# EAGLE design screwshield-v1.0 (EAGLE 6.2)
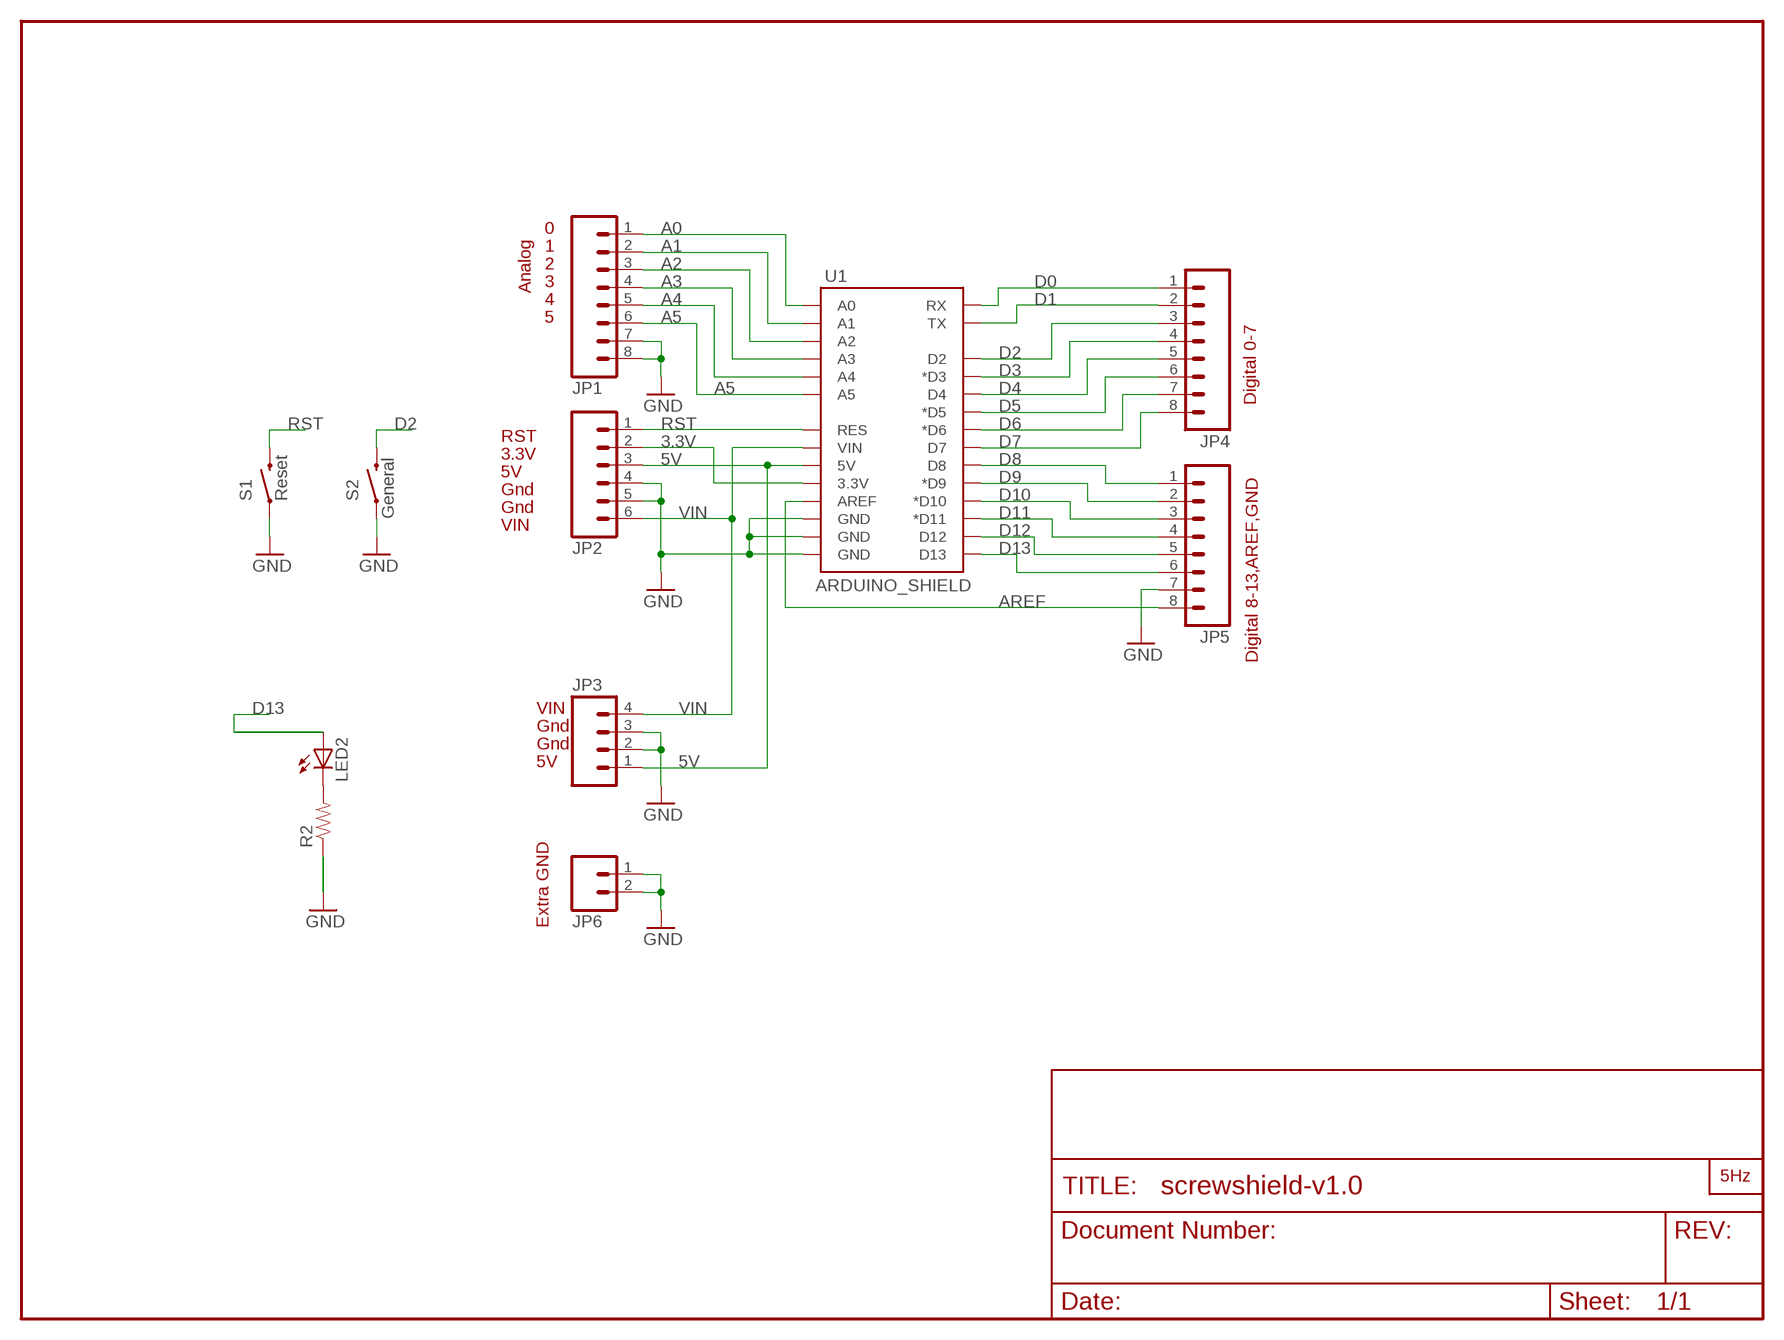
[diagram p0: schematic, sheet 1]

## Parts
JP1  M083.5MM-8  [SCREWTERMINAL-3.5MM-8]
JP2  M063.5MM-6  [SCREWTERMINAL-3.5MM-6]
JP3  M04SCREW  [SCREWTERMINAL-3.5MM-4]
JP4  M083.5MM-8  [SCREWTERMINAL-3.5MM-8]
JP5  M083.5MM-8  [SCREWTERMINAL-3.5MM-8]
JP6  M023.5MM  [SCREWTERMINAL-3.5MM-2]
LED2  LED0603  [LED-0603]
R2  RESISTOR0603-RES  [0603-RES]
S1  Reset  SWITCH-MOMENTARY-2PTH  [TACTILE-PTH]
S2  General  SWITCH-MOMENTARY-2PTH  [TACTILE-PTH]
U1  ARDUINO_SHIELD  ARDUINO_SHIELDNOHOLES  [DUEMILANOVE_SHIELD_NOHOLES]
U$1  LOGO_SILKL15MM  [LARGO_15MM]

## Nets
3.3V: JP2.2 U1.3.3V
5V: JP2.3 JP3.1 U1.5V
A0: JP1.1 U1.A0
A1: JP1.2 U1.A1
A2: JP1.3 U1.A2
A3: JP1.4 U1.A3
A4: JP1.5 U1.A4
A5: JP1.6 U1.A5
AREF: JP5.8 U1.AREF
D0: JP4.1 U1.RX
D1: JP4.2 U1.TX
D2: JP4.3 S2.3 U1.D2
D3: JP4.4 U1.D3(*D3)
D4: JP4.5 U1.D4
D5: JP4.6 U1.D5(*D5)
D6: JP4.7 U1.D6(*D6)
D7: JP4.8 U1.D7
D8: JP5.1 U1.D8
D9: JP5.2 U1.D9(*D9)
D10: JP5.3 U1.D10(*D10)
D11: JP5.4 U1.D11(*D11)
D12: JP5.5 U1.D12
D13: JP5.6 LED2.A U1.D13
GND: JP1.7 JP1.8 JP2.4 JP2.5 JP3.2 JP3.3 JP5.7 JP6.1 JP6.2 R2.1 S1.1 S2.1 U1.GND@0(GND) U1.GND@1(GND) U1.GND@2(GND)
N$1: LED2.C R2.2
RST: JP2.1 S1.3 U1.RES
VIN: JP2.6 JP3.4 U1.VIN

## Notes on the sheet
- 0
- Analog
- 1
- 2
- 3
- 4
- 5
- Digital 0-7
- RST
- 3.3V
- 5V
- Gnd
- Gnd
- VIN
- Digital 8-13,AREF,GND
- VIN
- Gnd
- Gnd
- 5V
- Extra GND

## Library data of the parts
JP1 JP4 JP5 = SparkFun:M08: Header 8 Standard 8-pin 0.1" header. Use with straight break away headers (SKU : PRT-00116), right angle break away headers (PRT-00553), swiss pins (PRT-00743), machine pins (PRT-00117), and female headers (PRT-00115).
JP2 = SparkFun:M06: Header 6 Standard 6-pin 0.1" header. Use with straight break away headers (SKU : PRT-00116), right angle break away headers (PRT-00553), swiss pins (PRT-00743), machine pins (PRT-00117), and female headers (PRT-00115). Molex polarized connector foot print use with SKU : PRT-08094 with associated crimp pins and housings. NOTES ON THE VARIANTS LOCK and LOCK_LONGPADS... This footprint was designed to help hold the alignment of a through-hole component (i.e. 6-pin header) while soldering it into place. You may notice that each hole has been shifted either up or down by 0.005 of an inch from it's more standard position (which is a perfectly straight line). This slight alteration caused the pins (the squares in the middle) to touch the edges of the holes. Because they are alternating, it causes a "brace" to hold the component in place. 0.005 has proven to be the perfect amount of "off-center" position when using our standard breakaway headers. Although looks a little odd when you look at the bare footprint, once you have a header in there, the alteration is very hard to notice. Also, if you push a header all the way into place, it is covered up entirely on the bottom side. This idea of altering the position of holes to aid alignment will be further integrated into the Sparkfun Library for other footprints. It can help hold any component with 3 or more connection pins.
JP3 = SparkFun:M04: Header 4 Standard 4-pin 0.1" header. Use with straight break away headers (SKU : PRT-00116), right angle break away headers (PRT-00553), swiss pins (PRT-00743), machine pins (PRT-00117), and female headers (PRT-00115). Molex polarized connector foot print use with SKU : PRT-08231 with associated crimp pins and housings.
JP6 = SparkFun:M02: Header 2 Standard 2-pin 0.1" header. Use with straight break away headers (SKU : PRT-00116), right angle break away headers (PRT-00553), swiss pins (PRT-00743), machine pins (PRT-00117), and female headers (PRT-00115). Molex polarized connector foot print use with SKU : PRT-08233 with associated crimp pins and housings.
LED2 = SparkFun:LED: LEDs Standard schematic elements and footprints for 5mm, 3mm, 1206, and 0603 sized LEDs. 5mm - Spark Fun Electronics SKU : COM-00529 (and others)
R2 = SparkFun:RESISTOR: Resistor Basic schematic elements and footprints for 0603, 1206, and PTH resistors.
S1 S2 = SparkFun:SWITCH-MOMENTARY-2
U1 = SparkFun:ARDUINO_SHIELD
U$1 = LOGO:LOGO_SILK

## Board
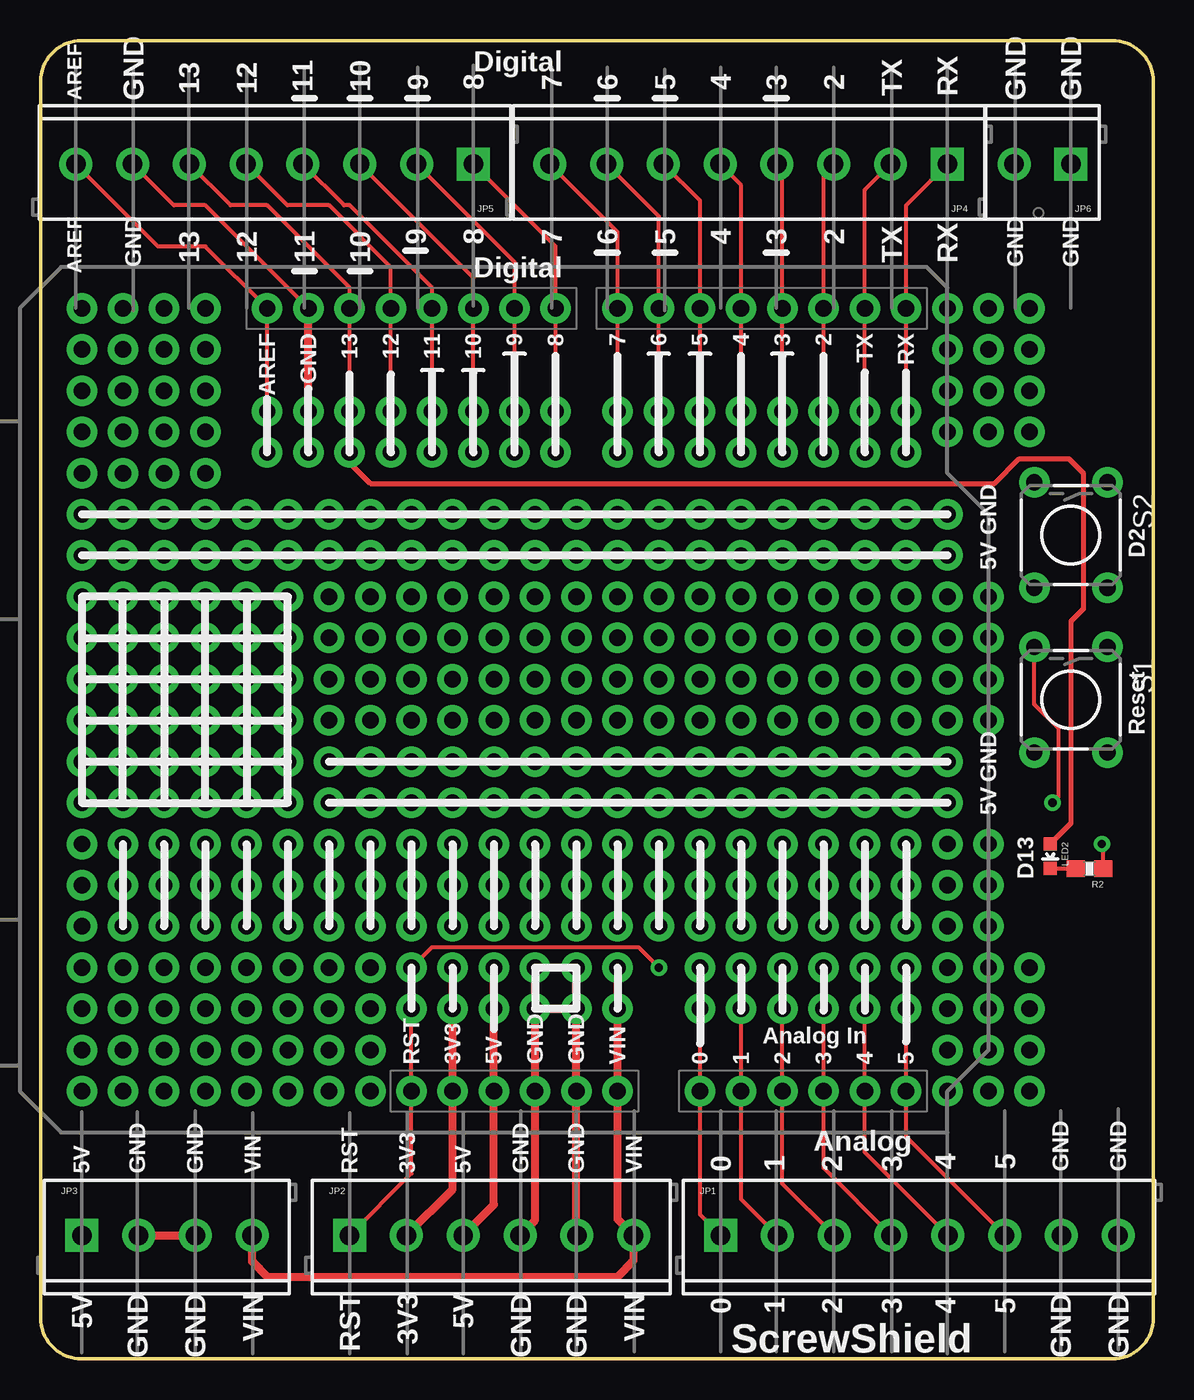
[diagram p1: board, top side]
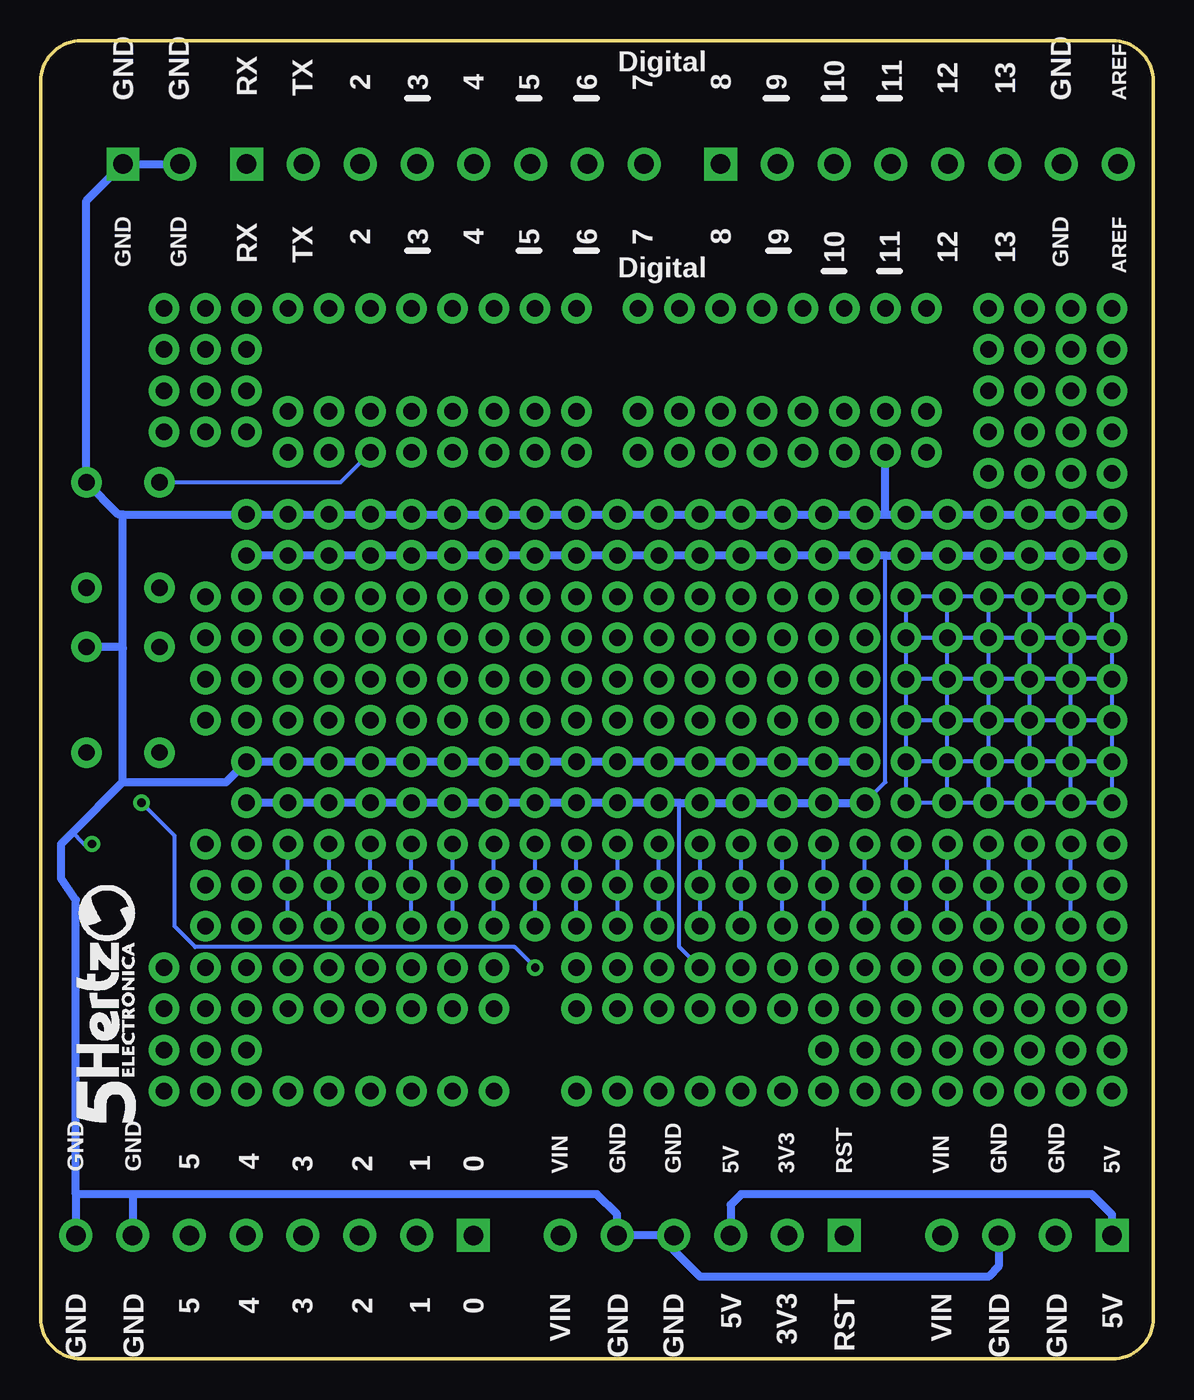
[diagram p2: board, bottom side, seen from below]

Size 68.58 x 81.28 mm. Coordinates in mm from the lower left corner, seen from the top.
Outline: 2.54,0 66.04,0 arc90 68.58,2.54 68.58,78.74 arc90 66.04,81.28 2.54,81.28 arc90 0,78.74 0,2.54 arc90 2.54,0
Copper layers (1*16): Top 0.035mm / dielectric 1.5mm / Bottom 0.035mm
Design rules: minimum track width 8mil, minimum drill 20mil, track to track 8mil, track to pad 8mil, pad to pad 8mil, via to via 8mil, smd to smd 8mil, copper to edge 10mil, drill to drill 8mil, minimum pad ring 12mil, minimum via ring 10mil, stop-mask expansion 4mil, vias tented up to drill 25mil, thermal gap 10mil

### Footprints (pad centres in the part's own frame; a part is rotated, then mirrored left to right if it is on the bottom)
SCREWTERMINAL-3.5MM-8 = drill 1.2 pad 2.032 square: 1 0,0 | drill 1.2 pad 2.032: 2 3.5,0; 3 7,0; 4 10.5,0; 5 14,0; 6 17.5,0; 7 21,0; 8 24.5,0
SCREWTERMINAL-3.5MM-6 = drill 1.2 pad 2.032 square: 1 0,0 | drill 1.2 pad 2.032: 2 3.5,0; 3 7,0; 4 10.5,0; 5 14,0; 6 17.5,0
SCREWTERMINAL-3.5MM-4 = drill 1.2 pad 2.032 square: 1 0,0 | drill 1.2 pad 2.032: 2 3.5,0; 3 7,0; 4 10.5,0
SCREWTERMINAL-3.5MM-2 = drill 1.2 pad 2.032 square: 1 0,0 | drill 1.2 pad 2.032: 2 3.5,0
LED-0603 = smd 0.8 x 0.8: A 0,-0.75; C 0,0.75
0603-RES = smd 1.1 x 1: 1 -0.85,0; 2 0.85,0
TACTILE-PTH = drill 1.016 pad 1.88: 1 -3.251,2.261; 2 3.251,2.261; 3 -3.251,-2.261; 4 3.251,-2.261
DUEMILANOVE_SHIELD_NOHOLES = drill 1.016 pad 1.88: 3.3V 50.8,26.67; 5V 50.8,29.21; A0 50.8,41.91; A1 50.8,44.45; A2 50.8,46.99; A3 50.8,49.53; A4 50.8,52.07; A5 50.8,54.61; AREF 2.54,15.24; D2 2.54,49.53; D3 2.54,46.99; D4 2.54,44.45; D5 2.54,41.91; D6 2.54,39.37; D7 2.54,36.83; D8 2.54,33.02; D9 2.54,30.48; D10 2.54,27.94; D11 2.54,25.4; D12 2.54,22.86; D13 2.54,20.32; GND@0 50.8,31.75; GND@1 50.8,34.29; GND@2 2.54,17.78; RES 50.8,24.13; RX 2.54,54.61; TX 2.54,52.07; VIN 50.8,36.83

### Placement (x,y rotation side)
JP1  41.91,7.62 0 top
JP2  19.05,7.62 0 top
JP3  2.54,7.62 0 top
JP4  55.88,73.66 180 top
JP5  26.67,73.66 180 top
JP6  63.5,73.66 180 top
LED2  62.23,30.99 180 top
R2  64.64,30.23 180 top
S1  63.5,40.64 270 top
S2  63.5,50.8 270 top
U1  -1.27,67.31 270 top
U$1  62.74,14.61 90 bottom

### Tracks (layer width: path | path; a pad name or v marks a point on that pad's centre or on a via)
3.3V  (via drill 1.02 pad 1.88)
  Top 0.508: JP2.2 25.4,10.47 U1.3.3V v25.4,21.59 v25.4,24.13
5V  (via drill 1.02 pad 1.88)
  Top 0.508: v27.94,24.13 v27.94,21.59 U1.5V 27.94,9.51 JP2.3
  Bottom 0.254: 16.51,49.53 16.51,35.56 v17.78,34.29 | v27.94,24.13 29.21,25.4 29.21,34.29
  Bottom 0.508: v55.88,34.29 v53.34,34.29 v50.8,34.29 v48.26,34.29 v45.72,34.29 v43.18,34.29 v40.64,34.29 v38.1,34.29 v35.56,34.29 v33.02,34.29 v30.48,34.29 29.21,34.29 v27.94,34.29 v25.4,34.29 v22.86,34.29 v20.32,34.29 v17.78,34.29 | v2.54,49.53 v5.08,49.53 v7.62,49.53 v10.16,49.53 v12.7,49.53 v15.24,49.53 16.51,49.53 v17.78,49.53 v20.32,49.53 v22.86,49.53 v25.4,49.53 v27.94,49.53 v30.48,49.53 v33.02,49.53 v35.56,49.53 v38.1,49.53 v40.64,49.53 v43.18,49.53 v45.72,49.53 v48.26,49.53 v50.8,49.53 v53.34,49.53 v55.88,49.53 | JP2.3 26.05,9.51 25.4,10.16 3.81,10.16 2.54,8.89 JP3.1
A0  (via drill 1.02 pad 1.88)
  Top 0.254: v40.64,24.13 v40.64,21.59 U1.A0 40.64,8.89 JP1.1
A1  (via drill 1.02 pad 1.88)
  Top 0.254: v43.18,24.13 v43.18,21.59 U1.A1 43.18,9.85 JP1.2
A2  (via drill 1.02 pad 1.88)
  Top 0.254: v45.72,24.13 v45.72,21.59 U1.A2 45.72,10.81 JP1.3
A3  (via drill 1.02 pad 1.88)
  Top 0.254: v48.26,24.13 v48.26,21.59 U1.A3 48.26,11.77 JP1.4
A4  (via drill 1.02 pad 1.88)
  Top 0.254: v50.8,24.13 v50.8,21.59 U1.A4 50.8,12.73 JP1.5
A5  (via drill 1.02 pad 1.88)
  Top 0.254: v53.34,24.13 v53.34,21.59 U1.A5 53.34,13.69 JP1.6
AREF  (via drill 1.02 pad 1.88)
  Top 0.254: v13.97,55.88 v13.97,58.42 U1.AREF 10.16,68.58 7.25,68.58 JP5.8
B1  (via drill 1.02 pad 1.88)
  Bottom 0.254: v5.08,31.75 v5.08,29.21 v5.08,26.67
B2  (via drill 1.02 pad 1.88)
  Bottom 0.254: v7.62,26.67 v7.62,29.21 v7.62,31.75
B3  (via drill 1.02 pad 1.88)
  Bottom 0.254: v10.16,31.75 v10.16,29.21 v10.16,26.67
B4  (via drill 1.02 pad 1.88)
  Bottom 0.254: v12.7,26.67 v12.7,29.21 v12.7,31.75
B5  (via drill 1.02 pad 1.88)
  Bottom 0.254: v15.24,26.67 v15.24,29.21 v15.24,31.75
B6  (via drill 1.02 pad 1.88)
  Bottom 0.254: v17.78,31.75 v17.78,29.21 v17.78,26.67
B7  (via drill 1.02 pad 1.88)
  Bottom 0.254: v20.32,26.67 v20.32,29.21 v20.32,31.75
B8  (via drill 1.02 pad 1.88)
  Bottom 0.254: v22.86,31.75 v22.86,29.21 v22.86,26.67
B9  (via drill 1.02 pad 1.88)
  Bottom 0.254: v25.4,26.67 v25.4,29.21 v25.4,31.75
B10  (via drill 1.02 pad 1.88)
  Bottom 0.254: v27.94,31.75 v27.94,29.21 v27.94,26.67
B11  (via drill 1.02 pad 1.88)
  Bottom 0.254: v30.48,26.67 v30.48,29.21 v30.48,31.75
B12  (via drill 1.02 pad 1.88)
  Bottom 0.254: v33.02,31.75 v33.02,29.21 v33.02,26.67
B13  (via drill 1.02 pad 1.88)
  Bottom 0.254: v35.56,26.67 v35.56,29.21 v35.56,31.75
B14  (via drill 1.02 pad 1.88)
  Bottom 0.254: v38.1,31.75 v38.1,29.21 v38.1,26.67
B15  (via drill 1.02 pad 1.88)
  Bottom 0.254: v40.64,26.67 v40.64,29.21 v40.64,31.75
B16  (via drill 1.02 pad 1.88)
  Bottom 0.254: v43.18,31.75 v43.18,29.21 v43.18,26.67
B17  (via drill 1.02 pad 1.88)
  Bottom 0.254: v45.72,26.67 v45.72,29.21 v45.72,31.75
B18  (via drill 1.02 pad 1.88)
  Bottom 0.254: v48.26,31.75 v48.26,29.21 v48.26,26.67
B19  (via drill 1.02 pad 1.88)
  Bottom 0.254: v50.8,26.67 v50.8,29.21 v50.8,31.75
B20  (via drill 1.02 pad 1.88)
  Bottom 0.254: v53.34,31.75 v53.34,29.21 v53.34,26.67
B21  (via drill 1.02 pad 1.88)
  other vias: 55.88,29.21
CB1  (via drill 1.02 pad 1.88)
  Bottom 0.254: v12.7,46.99 v15.24,46.99 v15.24,44.45 | v15.24,41.91 v15.24,44.45 | v12.7,44.45 v15.24,44.45 | v12.7,44.45 v12.7,46.99 | v10.16,46.99 v12.7,46.99 | v7.62,46.99 v10.16,46.99 | v10.16,44.45 v12.7,44.45 | v10.16,44.45 v10.16,46.99 | v12.7,41.91 v15.24,41.91 | v12.7,41.91 v12.7,44.45 | v15.24,39.37 v15.24,41.91 | v15.24,36.83 v15.24,39.37 | v12.7,39.37 v15.24,39.37 | v12.7,39.37 v12.7,41.91 | v10.16,41.91 v12.7,41.91 | v10.16,41.91 v10.16,44.45 | v7.62,44.45 v10.16,44.45 | v7.62,44.45 v7.62,46.99 | v5.08,46.99 v7.62,46.99 | v5.08,46.99 v2.54,46.99 v2.54,44.45 | v5.08,44.45 v7.62,44.45 | v5.08,44.45 v5.08,46.99 | v7.62,41.91 v10.16,41.91 | v7.62,41.91 v7.62,44.45 | v10.16,39.37 v12.7,39.37 | v10.16,39.37 v10.16,41.91 | v12.7,36.83 v15.24,36.83 | v12.7,36.83 v12.7,39.37 | v15.24,36.83 v15.24,34.29 v12.7,34.29 | v12.7,34.29 v12.7,36.83 | v10.16,36.83 v12.7,36.83 | v10.16,36.83 v10.16,39.37 | v7.62,39.37 v10.16,39.37 | v7.62,39.37 v7.62,41.91 | v2.54,44.45 v5.08,44.45 | v5.08,41.91 v7.62,41.91 | v5.08,41.91 v5.08,44.45 | v2.54,41.91 v5.08,41.91 | v2.54,41.91 v2.54,44.45 | v5.08,39.37 v7.62,39.37 | v5.08,39.37 v5.08,41.91 | v7.62,36.83 v10.16,36.83 | v7.62,36.83 v7.62,39.37 | v10.16,34.29 v12.7,34.29 | v10.16,34.29 v10.16,36.83 | v7.62,34.29 v10.16,34.29 | v7.62,34.29 v7.62,36.83 | v2.54,39.37 v5.08,39.37 | v2.54,39.37 v2.54,41.91 | v5.08,36.83 v7.62,36.83 | v5.08,36.83 v5.08,39.37 | v2.54,36.83 v5.08,36.83 | v2.54,36.83 v2.54,39.37 | v5.08,34.29 v7.62,34.29 | v5.08,34.29 v5.08,36.83 | v5.08,34.29 v2.54,34.29 v2.54,36.83
D0  (via drill 1.02 pad 1.88)
  Top 0.254: JP4.1 53.34,71.12 U1.RX v53.34,58.42 v53.34,55.88
D1  (via drill 1.02 pad 1.88)
  Top 0.254: JP4.2 50.8,72.08 U1.TX v50.8,58.42 v50.8,55.88
D2  (via drill 1.02 pad 1.88)
  Top 0.254: JP4.3 48.26,73.04 U1.D2 v48.26,58.42 v48.26,55.88
  Bottom 0.254: S2.3 50.09,54.05 v48.26,55.88
D3  (via drill 1.02 pad 1.88)
  Top 0.254: JP4.4 45.72,73.32 U1.D3 v45.72,58.42 v45.72,55.88
D4  (via drill 1.02 pad 1.88)
  Top 0.254: JP4.5 43.18,72.36 U1.D4 v43.18,58.42 v43.18,55.88
D5  (via drill 1.02 pad 1.88)
  Top 0.254: JP4.6 40.64,71.4 U1.D5 v40.64,58.42 v40.64,55.88
D6  (via drill 1.02 pad 1.88)
  Top 0.254: JP4.7 38.1,70.44 U1.D6 v38.1,58.42 v38.1,55.88
D7  (via drill 1.02 pad 1.88)
  Top 0.254: JP4.8 35.56,69.48 U1.D7 v35.56,58.42 v35.56,55.88
D8  (via drill 1.02 pad 1.88)
  Top 0.254: JP5.1 31.75,68.58 U1.D8 v31.75,58.42 v31.75,55.88
D9  (via drill 1.02 pad 1.88)
  Top 0.254: JP5.2 29.21,67.62 U1.D9 v29.21,55.88 v29.21,58.42
D10  (via drill 1.02 pad 1.88)
  Top 0.254: JP5.3 26.67,66.66 U1.D10 v26.67,58.42 v26.67,55.88
D11  (via drill 1.02 pad 1.88)
  Top 0.254: JP5.4 18.71,71.12 19.05,71.12 24.13,66.04 U1.D11 v24.13,55.88 v24.13,58.42
D12  (via drill 1.02 pad 1.88)
  Top 0.254: JP5.5 15.21,71.12 17.78,71.12 21.59,67.31 U1.D12 v21.59,58.42 v21.59,55.88
D13  (via drill 1.02 pad 1.88)
  Top 0.254: JP5.6 11.71,71.12 13.97,71.12 19.05,66.04 U1.D13 v19.05,58.42 v19.05,55.88 | LED2.A
  Top 0.305: v19.05,55.88 19.05,55.24 20.32,53.98 58.8,53.98 60.32,55.5 63.37,55.5 64.26,54.61 64.26,46.23 63.5,45.47 63.5,33.02 LED2.A
GND  (via drill 0.51, 1.02 pad 1.88)
  Top 0.254: U1.GND@2 10.16,71.12 8.21,71.12 JP5.7 | R2.1 65.49,31.66 v65.41,31.75
  Top 0.508: JP3.2 JP3.3 | v33.02,21.59 U1.GND@1 33.02,7.65 JP2.5 | JP2.4 30.48,8.55 U1.GND@0 v30.48,21.59 | v30.48,21.59 v30.48,24.13 v33.02,24.13 v33.02,21.59 | v30.48,21.59 v33.02,21.59 | U1.GND@2 v16.51,58.42 v16.51,55.88
  Bottom 0.254: JP2.5 33.02,7.59 | v65.41,31.75 65.91,31.75 66.61,32.45
  Bottom 0.508: 16.51,52.07 v17.78,52.07 v20.32,52.07 v22.86,52.07 v25.4,52.07 v27.94,52.07 v30.48,52.07 v33.02,52.07 v35.56,52.07 v38.1,52.07 v40.64,52.07 v43.18,52.07 v45.72,52.07 v48.26,52.07 v50.8,52.07 v53.34,52.07 v55.88,52.07 63.5,52.07 | 16.51,52.07 v15.24,52.07 v12.7,52.07 v10.16,52.07 v7.62,52.07 v5.08,52.07 v2.54,52.07 | JP3.3 9.54,5.7 10.16,5.08 27.94,5.08 29.55,6.69 JP2.4 JP2.5 33.05,8.92 34.29,10.16 62.87,10.16 | 63.5,52.07 63.78,52.07 S2.1 65.76,71.4 JP6.1 JP6.2 | 66.41,10.16 JP1.8 | 66.41,10.16 66.41,28.31 67.31,29.63 67.31,31.75 66.61,32.45 63.5,35.56 | 62.87,10.16 66.41,10.16 | JP1.7 62.91,10.12 62.87,10.16 | 63.5,35.56 63.5,43.81 | 63.5,43.81 63.5,52.07 | S1.1 63.58,43.89 63.5,43.81 | v17.78,36.83 v20.32,36.83 v22.86,36.83 v25.4,36.83 v27.94,36.83 v30.48,36.83 v33.02,36.83 v35.56,36.83 v38.1,36.83 v40.64,36.83 v43.18,36.83 v45.72,36.83 v48.26,36.83 v50.8,36.83 v53.34,36.83 v55.88,36.83 57.15,35.56 63.5,35.56 | 16.51,52.07 v16.51,55.88
N$1
  Top 0.254: LED2.C R2.2
N$2  (via drill 1.02 pad 1.88)
  other vias: 55.88,31.75
N$3  (via drill 1.02 pad 1.88)
  other vias: 55.88,26.67
N$4  (via drill 1.02 pad 1.88)
  other vias: 2.54,16.51
N$5  (via drill 1.02 pad 1.88)
  other vias: 2.54,19.05
N$9  (via drill 1.02 pad 1.88)
  other vias: 2.54,24.13
N$10  (via drill 1.02 pad 1.88)
  other vias: 2.54,21.59
N$11  (via drill 1.02 pad 1.88)
  other vias: 5.08,24.13
N$12  (via drill 1.02 pad 1.88)
  other vias: 5.08,59.69
N$13  (via drill 1.02 pad 1.88)
  other vias: 5.08,57.15
N$14  (via drill 1.02 pad 1.88)
  other vias: 7.62,57.15
N$15  (via drill 1.02 pad 1.88)
  other vias: 7.62,59.69
N$16  (via drill 1.02 pad 1.88)
  other vias: 10.16,59.69
N$17  (via drill 1.02 pad 1.88)
  other vias: 10.16,57.15
N$18  (via drill 1.02 pad 1.88)
  other vias: 7.62,24.13
N$19  (via drill 1.02 pad 1.88)
  other vias: 10.16,24.13
N$20  (via drill 1.02 pad 1.88)
  other vias: 12.7,24.13
N$22  (via drill 1.02 pad 1.88)
  other vias: 15.24,24.13
N$24  (via drill 1.02 pad 1.88)
  other vias: 17.78,24.13
N$25  (via drill 1.02 pad 1.88)
  other vias: 20.32,24.13
N$26  (via drill 1.02 pad 1.88)
  other vias: 5.08,21.59
N$27  (via drill 1.02 pad 1.88)
  other vias: 7.62,21.59
N$28  (via drill 1.02 pad 1.88)
  other vias: 10.16,21.59
N$29  (via drill 1.02 pad 1.88)
  other vias: 12.7,21.59
N$30  (via drill 1.02 pad 1.88)
  other vias: 15.24,21.59
N$31  (via drill 1.02 pad 1.88)
  other vias: 17.78,21.59
N$32  (via drill 1.02 pad 1.88)
  other vias: 20.32,21.59
N$33  (via drill 1.02 pad 1.88)
  other vias: 55.88,24.13
N$34  (via drill 1.02 pad 1.88)
  other vias: 58.42,24.13
N$35  (via drill 1.02 pad 1.88)
  other vias: 60.96,24.13
N$38  (via drill 1.02 pad 1.88)
  other vias: 55.88,21.59
N$39  (via drill 1.02 pad 1.88)
  other vias: 58.42,21.59
N$40  (via drill 1.02 pad 1.88)
  other vias: 60.96,21.59
N$43  (via drill 1.02 pad 1.88)
  other vias: 55.88,59.69
N$44  (via drill 1.02 pad 1.88)
  other vias: 58.42,59.69
N$45  (via drill 1.02 pad 1.88)
  other vias: 60.96,59.69
N$49  (via drill 1.02 pad 1.88)
  other vias: 55.88,57.15
N$51  (via drill 1.02 pad 1.88)
  other vias: 58.42,57.15
N$52  (via drill 1.02 pad 1.88)
  other vias: 60.96,57.15
N$53  (via drill 1.02 pad 1.88)
  other vias: 2.54,26.67
N$75  (via drill 1.02 pad 1.88)
  other vias: 58.42,26.67
N$80  (via drill 1.02 pad 1.88)
  other vias: 2.54,29.21
N$102  (via drill 1.02 pad 1.88)
  other vias: 58.42,29.21
N$107  (via drill 1.02 pad 1.88)
  other vias: 2.54,31.75
N$129  (via drill 1.02 pad 1.88)
  other vias: 58.42,31.75
N$194  (via drill 1.02 pad 1.88)
  other vias: 17.78,39.37
N$195  (via drill 1.02 pad 1.88)
  other vias: 20.32,39.37
N$196  (via drill 1.02 pad 1.88)
  other vias: 22.86,39.37
N$197  (via drill 1.02 pad 1.88)
  other vias: 25.4,39.37
N$198  (via drill 1.02 pad 1.88)
  other vias: 27.94,39.37
N$199  (via drill 1.02 pad 1.88)
  other vias: 30.48,39.37
N$200  (via drill 1.02 pad 1.88)
  other vias: 33.02,39.37
N$201  (via drill 1.02 pad 1.88)
  other vias: 35.56,39.37
N$202  (via drill 1.02 pad 1.88)
  other vias: 38.1,39.37
N$203  (via drill 1.02 pad 1.88)
  other vias: 40.64,39.37
N$204  (via drill 1.02 pad 1.88)
  other vias: 43.18,39.37
N$205  (via drill 1.02 pad 1.88)
  other vias: 45.72,39.37
N$206  (via drill 1.02 pad 1.88)
  other vias: 48.26,39.37
N$207  (via drill 1.02 pad 1.88)
  other vias: 50.8,39.37
N$208  (via drill 1.02 pad 1.88)
  other vias: 53.34,39.37
N$209  (via drill 1.02 pad 1.88)
  other vias: 55.88,39.37
N$210  (via drill 1.02 pad 1.88)
  other vias: 58.42,39.37
N$221  (via drill 1.02 pad 1.88)
  other vias: 17.78,41.91
N$222  (via drill 1.02 pad 1.88)
  other vias: 20.32,41.91
N$223  (via drill 1.02 pad 1.88)
  other vias: 22.86,41.91
N$224  (via drill 1.02 pad 1.88)
  other vias: 25.4,41.91
N$225  (via drill 1.02 pad 1.88)
  other vias: 27.94,41.91
N$226  (via drill 1.02 pad 1.88)
  other vias: 30.48,41.91
N$227  (via drill 1.02 pad 1.88)
  other vias: 33.02,41.91
N$228  (via drill 1.02 pad 1.88)
  other vias: 35.56,41.91
N$229  (via drill 1.02 pad 1.88)
  other vias: 38.1,41.91
N$230  (via drill 1.02 pad 1.88)
  other vias: 40.64,41.91
N$231  (via drill 1.02 pad 1.88)
  other vias: 43.18,41.91
N$232  (via drill 1.02 pad 1.88)
  other vias: 45.72,41.91
N$233  (via drill 1.02 pad 1.88)
  other vias: 48.26,41.91
N$234  (via drill 1.02 pad 1.88)
  other vias: 50.8,41.91
N$235  (via drill 1.02 pad 1.88)
  other vias: 53.34,41.91
N$236  (via drill 1.02 pad 1.88)
  other vias: 55.88,41.91
N$237  (via drill 1.02 pad 1.88)
  other vias: 58.42,41.91
N$248  (via drill 1.02 pad 1.88)
  other vias: 17.78,44.45
N$249  (via drill 1.02 pad 1.88)
  other vias: 20.32,44.45
N$250  (via drill 1.02 pad 1.88)
  other vias: 22.86,44.45
N$251  (via drill 1.02 pad 1.88)
  other vias: 25.4,44.45
N$252  (via drill 1.02 pad 1.88)
  other vias: 27.94,44.45
N$253  (via drill 1.02 pad 1.88)
  other vias: 30.48,44.45
N$254  (via drill 1.02 pad 1.88)
  other vias: 33.02,44.45
N$255  (via drill 1.02 pad 1.88)
  other vias: 35.56,44.45
N$256  (via drill 1.02 pad 1.88)
  other vias: 38.1,44.45
N$257  (via drill 1.02 pad 1.88)
  other vias: 40.64,44.45
N$258  (via drill 1.02 pad 1.88)
  other vias: 43.18,44.45
N$259  (via drill 1.02 pad 1.88)
  other vias: 45.72,44.45
N$260  (via drill 1.02 pad 1.88)
  other vias: 48.26,44.45
N$261  (via drill 1.02 pad 1.88)
  other vias: 50.8,44.45
N$262  (via drill 1.02 pad 1.88)
  other vias: 53.34,44.45
N$263  (via drill 1.02 pad 1.88)
  other vias: 55.88,44.45
N$264  (via drill 1.02 pad 1.88)
  other vias: 58.42,44.45
N$275  (via drill 1.02 pad 1.88)
  other vias: 17.78,46.99
N$276  (via drill 1.02 pad 1.88)
  other vias: 20.32,46.99
N$277  (via drill 1.02 pad 1.88)
  other vias: 22.86,46.99
N$278  (via drill 1.02 pad 1.88)
  other vias: 25.4,46.99
N$279  (via drill 1.02 pad 1.88)
  other vias: 27.94,46.99
N$280  (via drill 1.02 pad 1.88)
  other vias: 30.48,46.99
N$281  (via drill 1.02 pad 1.88)
  other vias: 33.02,46.99
N$282  (via drill 1.02 pad 1.88)
  other vias: 35.56,46.99
N$283  (via drill 1.02 pad 1.88)
  other vias: 38.1,46.99
N$284  (via drill 1.02 pad 1.88)
  other vias: 40.64,46.99
N$285  (via drill 1.02 pad 1.88)
  other vias: 43.18,46.99
N$286  (via drill 1.02 pad 1.88)
  other vias: 45.72,46.99
N$287  (via drill 1.02 pad 1.88)
  other vias: 48.26,46.99
N$288  (via drill 1.02 pad 1.88)
  other vias: 50.8,46.99
N$289  (via drill 1.02 pad 1.88)
  other vias: 53.34,46.99
N$290  (via drill 1.02 pad 1.88)
  other vias: 55.88,46.99
N$291  (via drill 1.02 pad 1.88)
  other vias: 58.42,46.99
N$350  (via drill 1.02 pad 1.88)
  other vias: 2.54,54.61
N$351  (via drill 1.02 pad 1.88)
  other vias: 5.08,54.61
N$352  (via drill 1.02 pad 1.88)
  other vias: 7.62,54.61
N$353  (via drill 1.02 pad 1.88)
  other vias: 10.16,54.61
N$377  (via drill 1.02 pad 1.88)
  other vias: 2.54,57.15
N$404  (via drill 1.02 pad 1.88)
  other vias: 2.54,59.69
N$430  (via drill 1.02 pad 1.88)
  other vias: 5.08,19.05
N$431  (via drill 1.02 pad 1.88)
  other vias: 7.62,19.05
N$432  (via drill 1.02 pad 1.88)
  other vias: 10.16,19.05
N$433  (via drill 1.02 pad 1.88)
  other vias: 12.7,19.05
N$434  (via drill 1.02 pad 1.88)
  other vias: 15.24,19.05
N$435  (via drill 1.02 pad 1.88)
  other vias: 17.78,19.05
N$436  (via drill 1.02 pad 1.88)
  other vias: 20.32,19.05
N$439  (via drill 1.02 pad 1.88)
  other vias: 5.08,16.51
N$440  (via drill 1.02 pad 1.88)
  other vias: 7.62,16.51
N$441  (via drill 1.02 pad 1.88)
  other vias: 10.16,16.51
N$442  (via drill 1.02 pad 1.88)
  other vias: 12.7,16.51
N$443  (via drill 1.02 pad 1.88)
  other vias: 15.24,16.51
N$444  (via drill 1.02 pad 1.88)
  other vias: 17.78,16.51
N$445  (via drill 1.02 pad 1.88)
  other vias: 20.32,16.51
N$447  (via drill 1.02 pad 1.88)
  other vias: 2.54,62.23
N$448  (via drill 1.02 pad 1.88)
  other vias: 5.08,62.23
N$449  (via drill 1.02 pad 1.88)
  other vias: 7.62,62.23
N$450  (via drill 1.02 pad 1.88)
  other vias: 55.88,19.05
N$451  (via drill 1.02 pad 1.88)
  other vias: 58.42,19.05
N$452  (via drill 1.02 pad 1.88)
  other vias: 60.96,19.05
N$455  (via drill 1.02 pad 1.88)
  other vias: 10.16,62.23
N$457  (via drill 1.02 pad 1.88)
  other vias: 2.54,64.77
N$458  (via drill 1.02 pad 1.88)
  other vias: 5.08,64.77
N$459  (via drill 1.02 pad 1.88)
  other vias: 7.62,64.77
N$460  (via drill 1.02 pad 1.88)
  other vias: 10.16,64.77
N$464  (via drill 1.02 pad 1.88)
  other vias: 55.88,16.51
N$465  (via drill 1.02 pad 1.88)
  other vias: 58.42,16.51
N$466  (via drill 1.02 pad 1.88)
  other vias: 60.96,16.51
N$478  (via drill 1.02 pad 1.88)
  other vias: 55.88,62.23
N$479  (via drill 1.02 pad 1.88)
  other vias: 58.42,62.23
N$480  (via drill 1.02 pad 1.88)
  other vias: 60.96,62.23
N$488  (via drill 1.02 pad 1.88)
  other vias: 55.88,64.77
N$489  (via drill 1.02 pad 1.88)
  other vias: 58.42,64.77
N$490  (via drill 1.02 pad 1.88)
  other vias: 60.96,64.77
RST  (via drill 0.51, 1.02 pad 1.88)
  Top 0.254: JP2.1 22.86,11.43 U1.RES v22.86,21.59 v22.86,24.13 24.13,25.4 36.83,25.4 v38.1,24.13 | S1.3 61.24,40.36 62.74,38.86 62.74,34.67 v62.36,34.29
  Bottom 0.254: v38.1,24.13 39.37,25.4 59.05,25.4 60.32,26.67 60.32,32.26 v62.36,34.29
VIN  (via drill 1.02 pad 1.88)
  Top 0.508: JP3.4 13.04,6.01 13.97,5.08 35.56,5.08 36.55,6.07 JP2.6 35.56,8.61 U1.VIN v35.56,21.59 v35.56,24.13

### Text on the board
tPlace: Digital | AREF | GND | 13 | 12 | 11 | 10 | 9 | 8 | 7 | 6 | 5 | 4 | 3 | 2 | TX | RX | GND | GND | 9 | 8 | 7 | 6 | 5 | 4 | 3 | 2 | 13 | 12 | 11 | 10 | TX | RX | AREF | GND | Digital | GND | GND | GND | 5V | D2 | Reset | GND | 5V | D13 | Analog | 0 | 1 | 2 | 3 | 4 | 5 | GND | GND | 5V | GND | GND | VIN | RST | 3V3 | 5V | GND | GND | VIN | 5V | GND | GND | VIN | RST | 3V3 | 5V | GND | GND | VIN | GND | GND | 0 | 1 | 2 | 3 | 4 | 5 | ScrewShield
bPlace: Digital | AREF | GND | 13 | 12 | 11 | 10 | 9 | 8 | 7 | 6 | 5 | 4 | 3 | 2 | TX | RX | GND | GND | 9 | 8 | 7 | 6 | 5 | 4 | 3 | 2 | 13 | 12 | 11 | 10 | TX | RX | AREF | GND | Digital | GND | GND | 0 | 1 | 2 | 3 | 4 | 5 | GND | GND | 5V | GND | GND | VIN | RST | 3V3 | 5V | GND | GND | VIN | 5V | GND | GND | VIN | RST | 3V3 | 5V | GND | GND | VIN | GND | GND | 0 | 1 | 2 | 3 | 4 | 5
tNames: Tod E. Kurt, John Edgar Park, Brian Jepson